# Altium schematic sheet Driver_v0.SchDoc
size 297 x 209 mm; ENG_APP_DATE: --/--/--; DSN_APP_DATE: --/--/--; CHK_APP_DATE: --/--/--; SheetNumber: 2; SheetTotal: 5
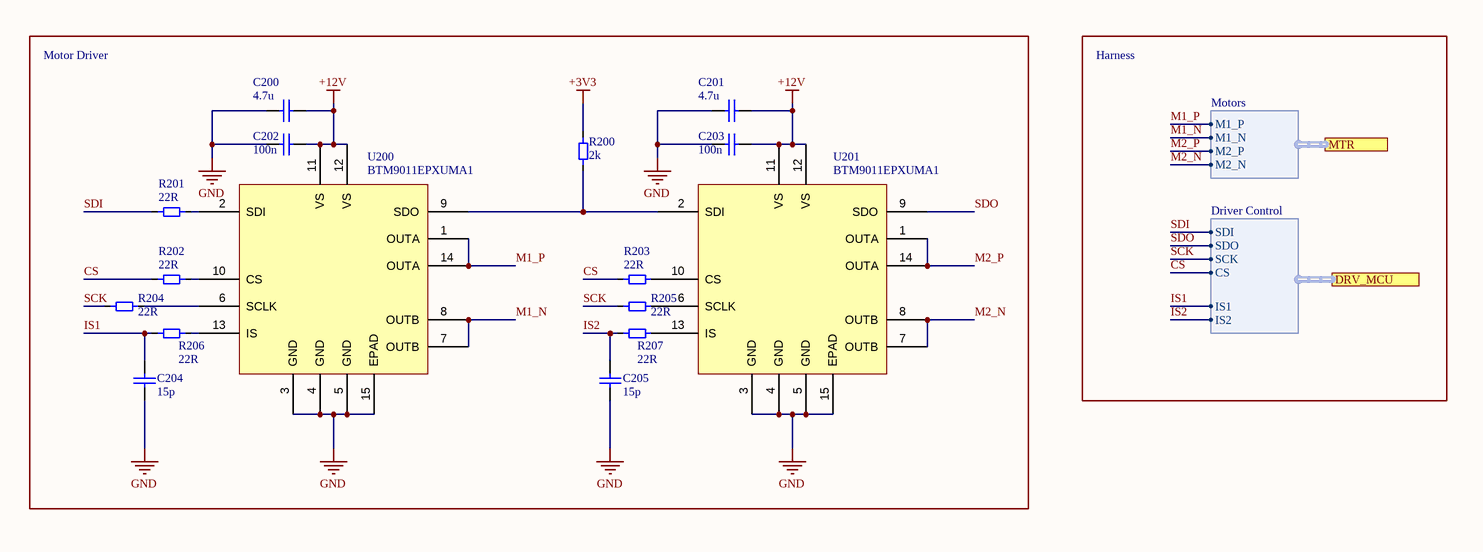
[diagram p0: Driver_v0.SchDoc, right]

## Parts
C200  4.7u  [MLCC_0603_M]
C201  4.7u  [MLCC_0603_M]
C202  100n  [MLCC_0603_M]
C203  100n  [MLCC_0603_M]
C204  15p  [MLCC_0603_M]
C205  15p  [MLCC_0603_M]
R200  2k  [Resistor_0603_M]
R201  22R  [Resistor_0603_M]
R202  22R  [Resistor_0603_M]
R203  22R  [Resistor_0603_M]
R204  22R  [Resistor_0603_M]
R205  22R  [Resistor_0603_M]
R206  22R  [Resistor_0603_M]
R207  22R  [Resistor_0603_M]
U200  BTM9011EPXUMA1  [BTM9011EPXUMA1]
U201  BTM9011EPXUMA1  [BTM9011EPXUMA1]

## Blocks framed on the sheet
Motor Driver: C200-C205 R200-R207 U200 U201

## Ports
DRV_MCU (harness Driver Control, see Overview[3B], MCU_USB[2A]), MTR (harness Motors, see Overview[3B], Headers[2A])

## Harnesses
Motors: M1_P, M1_N, M2_P, M2_N
Driver Control: SCK, SDO, IS1, SDI, IS2, CS

## Nets
+3V3: R200.2
+12V: C200.2 C201.2 C202.2 C203.2 U200.11(VS) U200.12(VS) U201.11(VS) U201.12(VS)
GND: C200.1 C201.1 C202.1 C203.1 C204.2 C205.2 U200.3(GND) U200.4(GND) U200.5(GND) U200.15(EPAD) U201.3(GND) U201.4(GND) U201.5(GND) U201.15(EPAD)
CS: R202.1 R203.1 ; port DRV_MCU.CS
IS1: C204.1 R206.1 ; port DRV_MCU.IS1
IS2: C205.1 R207.1 ; port DRV_MCU.IS2
M1_N: U200.7(OUTB) U200.8(OUTB) ; port MTR.M1_N
M1_P: U200.1(OUTA) U200.14(OUTA) ; port MTR.M1_P
M2_N: U201.7(OUTB) U201.8(OUTB) ; port MTR.M2_N
M2_P: U201.1(OUTA) U201.14(OUTA) ; port MTR.M2_P
SCK: R204.1 R205.1 ; port DRV_MCU.SCK
SDI: R201.1 ; port DRV_MCU.SDI
SDO: U201.9(SDO) ; port DRV_MCU.SDO
NetR200_1: R200.1 U200.9(SDO) U201.2(SDI)
NetR201_2: R201.2 U200.2(SDI)
NetR202_2: R202.2 U200.10(CS)
NetR203_2: R203.2 U201.10(CS)
NetR204_2: R204.2 U200.6(SCLK)
NetR205_2: R205.2 U201.6(SCLK)
NetR206_2: R206.2 U200.13(IS)
NetR207_2: R207.2 U201.13(IS)

## Notes on the sheet
- Harness
- THIS DOCUMENT AND THE DATA DISCLOSED HEREIN OR
- HEREWITH IS THE PROPERTY OF ALTIUM LIMITED AND MAY
- DWG NO:
- REVISION
- REV:
- DESCRIPTION
- DATE
- APPROVED
- BE FREELY DISTRIBUTED IN WHOLE. NO RIGHTS ARE
- RESERVED OR EXPRESS OR IMPLIED WARANTEE GIVEN.
- ENG:
- APPROVALS
- PROJECT
- DSN:
- CHK:
- REFERENCE DOCUMENTS
- PROJECT REVISION:
- TITLE
- DOCUMENT REVISION:
- DESIGN ITEM:
- BOM:
- FAB DWG:
- PCB DWG:
- ASSY DWG:
- SCALE:
- A3
- SIZE
- CAGE CODE
- FILE NAME
- DWG NO.
- SHEET
- OF
- REV

## Library data of the parts
C200 C201 = CMP-001-1257-1: MLCC, 0603, 4.7u, 10%, 35V, X5R; Manufacturer: Any; Value: 4,7µF; Capacitor Type: Ceramic; Dielectric: X5R; Tolerance: 10%; Voltage: 35V; Part number: MLCC, 0603, 4.7u, 10%, 35V, X5R; Case/Package: 0603; Mount: SMD; RoHS: Yes
C202 C203 = CMP-001-0755-1: MLCC, 0603, 100n, 10%, 35V, X7R; Manufacturer: Any; Capacitor Type: Ceramic; Value: 100nF; Voltage: 35V; Case/Package: 0603; Part number: MLCC, 0603, 100n, 10%, 35V, X7R; RoHS: Yes; Tolerance: 10%; Dielectric: X7R; Mount: SMD
C204 C205 = CMP-001-0474-1: MLCC, 0603, 15p, 5%, 50V, C0G/NP0; Manufacturer: Any; Value: 15pF; Capacitor Type: Ceramic; Dielectric: C0G/NP0; Case/Package: 0603; Part number: MLCC, 0603, 15p, 5%, 50V, C0G/NP0; Voltage: 50V; Mount: SMD; RoHS: Yes; Tolerance: 5%
R200 = CMP-001-0084-2: Resistor, 0603, 2k, 1%, 1/10W; Manufacturer: Any; Power: 100mW; Mount: SMD; Value: 2k; RoHS: Yes; Case/Package: 0603; Part number: Resistor, 0603, 2k, 1%, 1/10W; Tolerance: 1%
R201-R207 = CMP-001-0038-3: Resistor, 0603, 22R, 1%, 1/10W; Manufacturer: Any; Value: 22; Power: 100mW; Part number: Resistor, 0603, 22R, 1%, 1/10W; Tolerance: 1%; Case/Package: 0603; Mount: SMD; RoHS: Yes
U200 U201 = CMP-00022-3: DC Mtr Drive, Brush, 150DEGC, TSSOPEP-14 Rohs Compliant: Yes; Manufacturer: Infineon Technologies; Current - Output: 9.2A; Voltage - Supply: 4.5V ~ 40V; Interface: SPI; Output configuration: Full bridge; Motor Type - AC, DC: Brushed DC; REACH SVHC: Yes; RoHS: Compliant; Voltage - Load: 4.5V ~ 40V; Operating Temperature: -40C ~ 150C; Case/Package: 14-TSSOP; Mount: SMD; Part number: BTM9011EPXUMA1